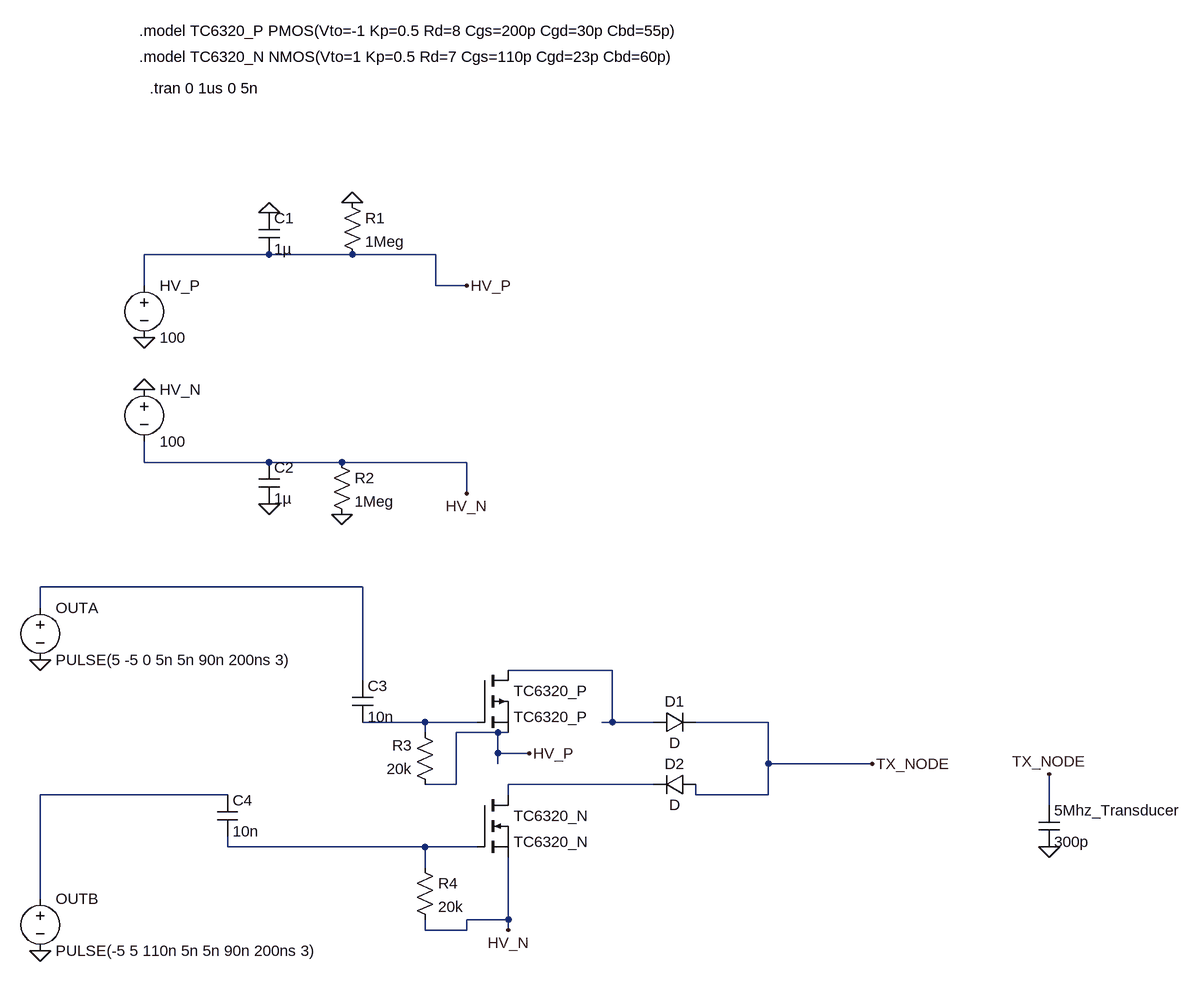
[diagram p0: schematic  tx_channel_sim.asc]
 tx_channel_sim.asc, the LTspice schematic file:
Version 4
SHEET 1 1968 1284
WIRE 160 144 -32 144
WIRE 288 144 160 144
WIRE 416 144 288 144
WIRE -32 192 -32 144
WIRE 416 192 416 144
WIRE 464 192 416 192
WIRE -32 464 -32 432
WIRE 160 464 -32 464
WIRE 272 464 160 464
WIRE 464 464 272 464
WIRE 464 512 464 464
WIRE 304 656 -192 656
WIRE -192 688 -192 656
WIRE 688 784 528 784
WIRE 304 800 304 656
WIRE 400 864 304 864
WIRE 480 864 400 864
WIRE 688 864 688 784
WIRE 688 864 672 864
WIRE 752 864 688 864
WIRE 928 864 816 864
WIRE 400 880 400 864
WIRE 512 880 448 880
WIRE 528 880 512 880
WIRE 512 912 512 880
WIRE 560 912 512 912
WIRE 512 928 512 912
WIRE 928 928 928 864
WIRE 1088 928 928 928
WIRE 448 960 448 880
WIRE 448 960 400 960
WIRE 752 960 528 960
WIRE 96 976 -192 976
WIRE 528 976 528 960
WIRE 816 976 816 960
WIRE 928 976 928 928
WIRE 928 976 816 976
WIRE 1360 992 1360 944
WIRE 96 1056 96 1040
WIRE 400 1056 96 1056
WIRE 480 1056 400 1056
WIRE 400 1088 400 1056
WIRE -192 1136 -192 976
WIRE 528 1168 528 1072
WIRE 528 1168 464 1168
WIRE 400 1184 400 1168
WIRE 464 1184 464 1168
WIRE 464 1184 400 1184
WIRE 528 1184 528 1168
FLAG -32 272 0
FLAG -32 352 0
FLAG 464 192 HV_P
FLAG 464 512 HV_N
FLAG 160 80 0
FLAG 272 544 0
FLAG 160 528 0
FLAG 288 64 0
FLAG 560 912 HV_P
FLAG 1088 928 TX_NODE
FLAG 528 1184 HV_N
FLAG 1360 944 TX_NODE
FLAG 1360 1056 0
FLAG -192 768 0
FLAG -192 1216 0
SYMBOL voltage -32 176 R0
SYMATTR InstName HV_P
SYMATTR Value 100
SYMBOL voltage -32 336 R0
SYMATTR InstName HV_N
SYMATTR Value 100
SYMBOL cap 144 80 R0
SYMATTR InstName C1
SYMATTR Value 1µ
SYMBOL cap 144 464 R0
SYMATTR InstName C2
SYMATTR Value 1µ
SYMBOL Res 272 48 R0
SYMATTR InstName R1
SYMATTR Value 1Meg
SYMBOL Res 256 448 R0
SYMATTR InstName R2
SYMATTR Value 1Meg
SYMBOL pmos 480 784 R0
SYMATTR InstName TC6320_P
SYMATTR Value TC6320_P
SYMBOL nmos 480 976 R0
SYMATTR InstName TC6320_N
SYMATTR Value TC6320_N
SYMBOL Cap 1344 992 R0
SYMATTR InstName 5Mhz_Transducer
SYMATTR Value 300p
SYMBOL Cap 288 800 R0
SYMATTR InstName C3
SYMATTR Value 10n
SYMBOL Cap 80 976 R0
SYMATTR InstName C4
SYMATTR Value 10n
SYMBOL Res 416 976 R180
WINDOW 0 36 76 Left 2
WINDOW 3 36 40 Left 2
SYMATTR InstName R3
SYMATTR Value 20k
SYMBOL Res 384 1072 R0
SYMATTR InstName R4
SYMATTR Value 20k
SYMBOL voltage -192 672 R0
SYMATTR InstName OUTA
SYMATTR Value PULSE(5 -5 0 5n 5n 90n 200ns 3)
SYMBOL voltage -192 1120 R0
SYMATTR InstName OUTB
SYMATTR Value PULSE(-5 5 110n 5n 5n 90n 200ns 3)
SYMBOL Diode 752 880 R270
WINDOW 0 32 32 VTop 2
WINDOW 3 0 32 VBottom 2
SYMATTR InstName D1
SYMBOL Diode 816 944 R90
WINDOW 0 0 32 VBottom 2
WINDOW 3 32 32 VTop 2
SYMATTR InstName D2
TEXT -40 -200 Left 2 !.model TC6320_P PMOS(Vto=-1 Kp=0.5 Rd=8 Cgs=200p Cgd=30p Cbd=55p)
TEXT -40 -160 Left 2 !.model TC6320_N NMOS(Vto=1 Kp=0.5 Rd=7 Cgs=110p Cgd=23p Cbd=60p)
TEXT -24 -112 Left 2 !.tran 0 1us 0 5n

The netlist it stands for:
*  tx_channel_sim.asc
V§HV_P HV_P 0 100
V§HV_N 0 HV_N 100
C1 0 HV_P 1µ
C2 HV_N 0 1µ
R1 0 HV_P 1Meg
R2 HV_N 0 1Meg
M§TC6320_P N002 N003 HV_P HV_P TC6320_P
M§TC6320_N N004 N006 HV_N HV_N TC6320_N
C§5Mhz_Transducer TX_NODE 0 300p
C3 N001 N003 10n
C4 N005 N006 10n
R3 HV_P N003 20k
R4 N006 HV_N 20k
V§OUTA N001 0 PULSE(5 -5 0 5n 5n 90n 200ns 3)
V§OUTB N005 0 PULSE(-5 5 110n 5n 5n 90n 200ns 3)
D1 N002 TX_NODE D
D2 TX_NODE N004 D
.model D D
.lib standard.dio
.model NMOS NMOS
.model PMOS PMOS
.lib standard.mos
.model TC6320_P PMOS(Vto=-1 Kp=0.5 Rd=8 Cgs=200p Cgd=30p Cbd=55p)
.model TC6320_N NMOS(Vto=1 Kp=0.5 Rd=7 Cgs=110p Cgd=23p Cbd=60p)
.tran 0 1us 0 5n
.backanno
.end